# EasyEDA Pro project ProProject_赤兔主板（夜燕flex）111_2024-08-22.epro, board 赤兔-PCB
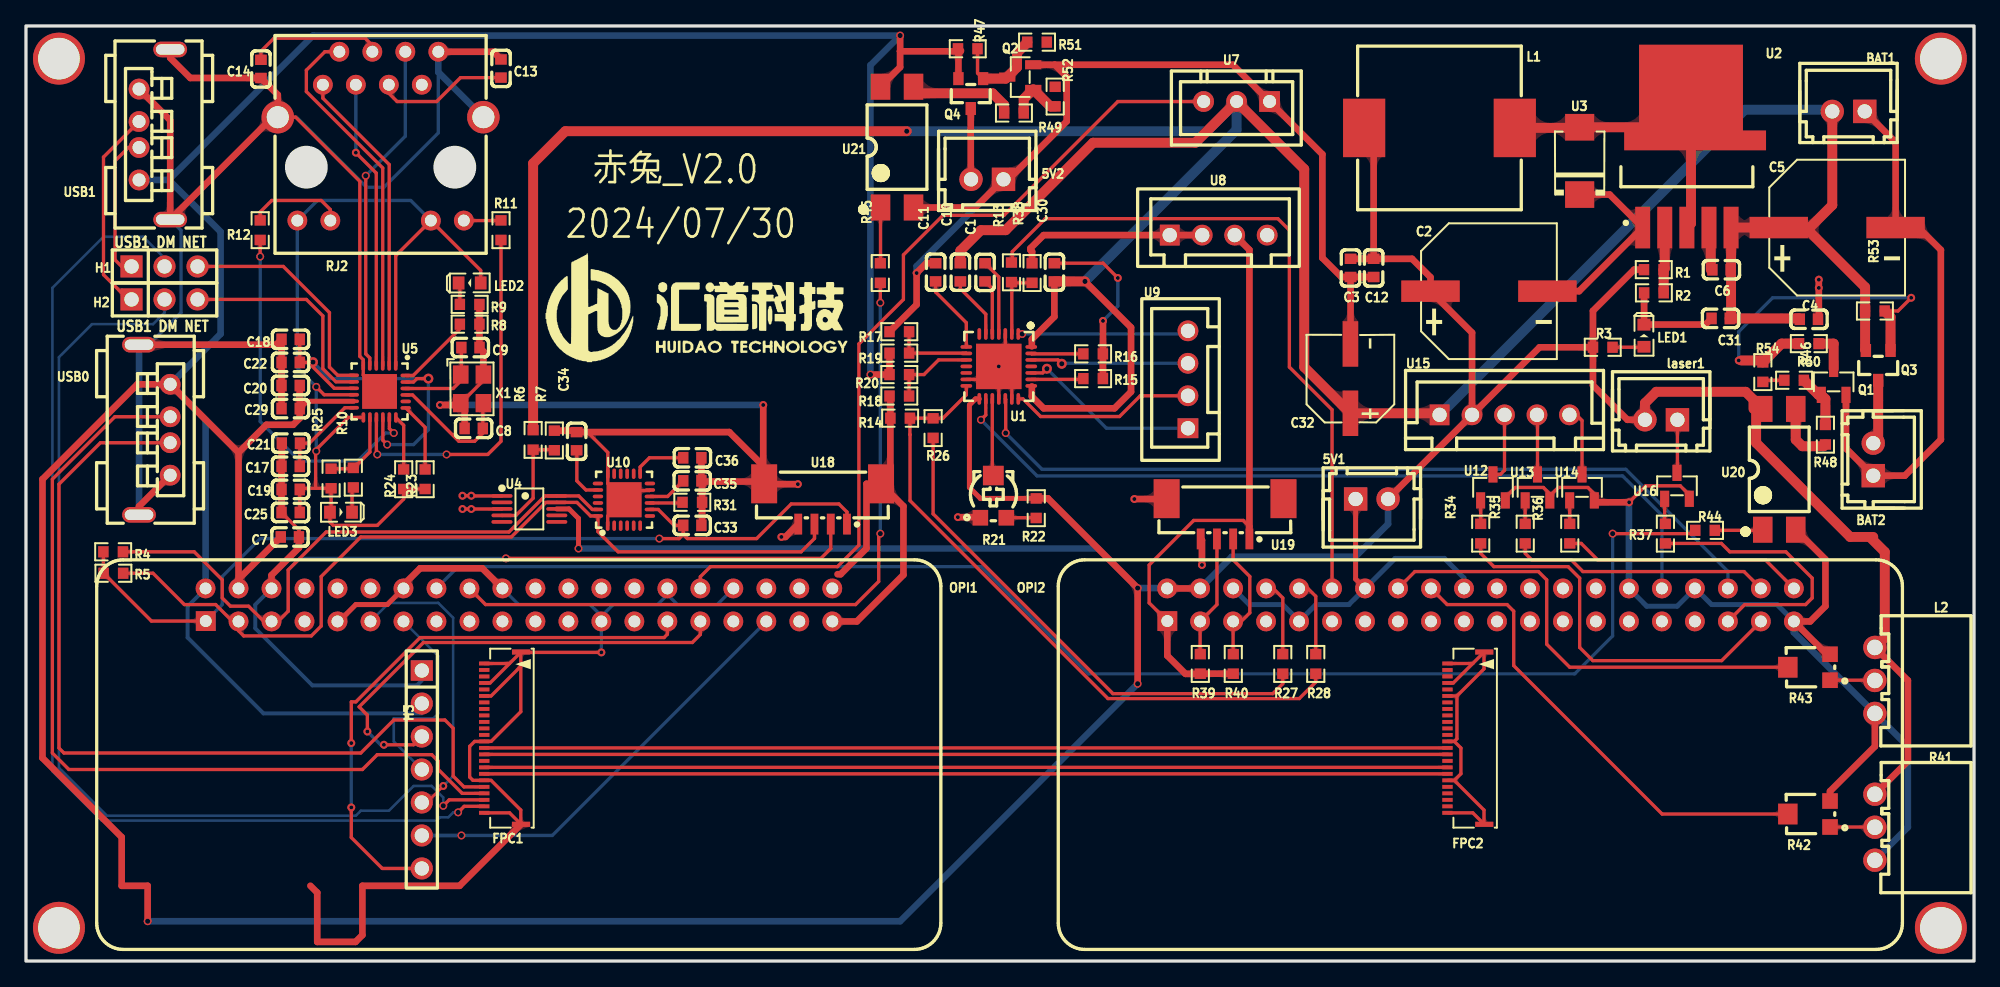
[diagram p6: board, top side]
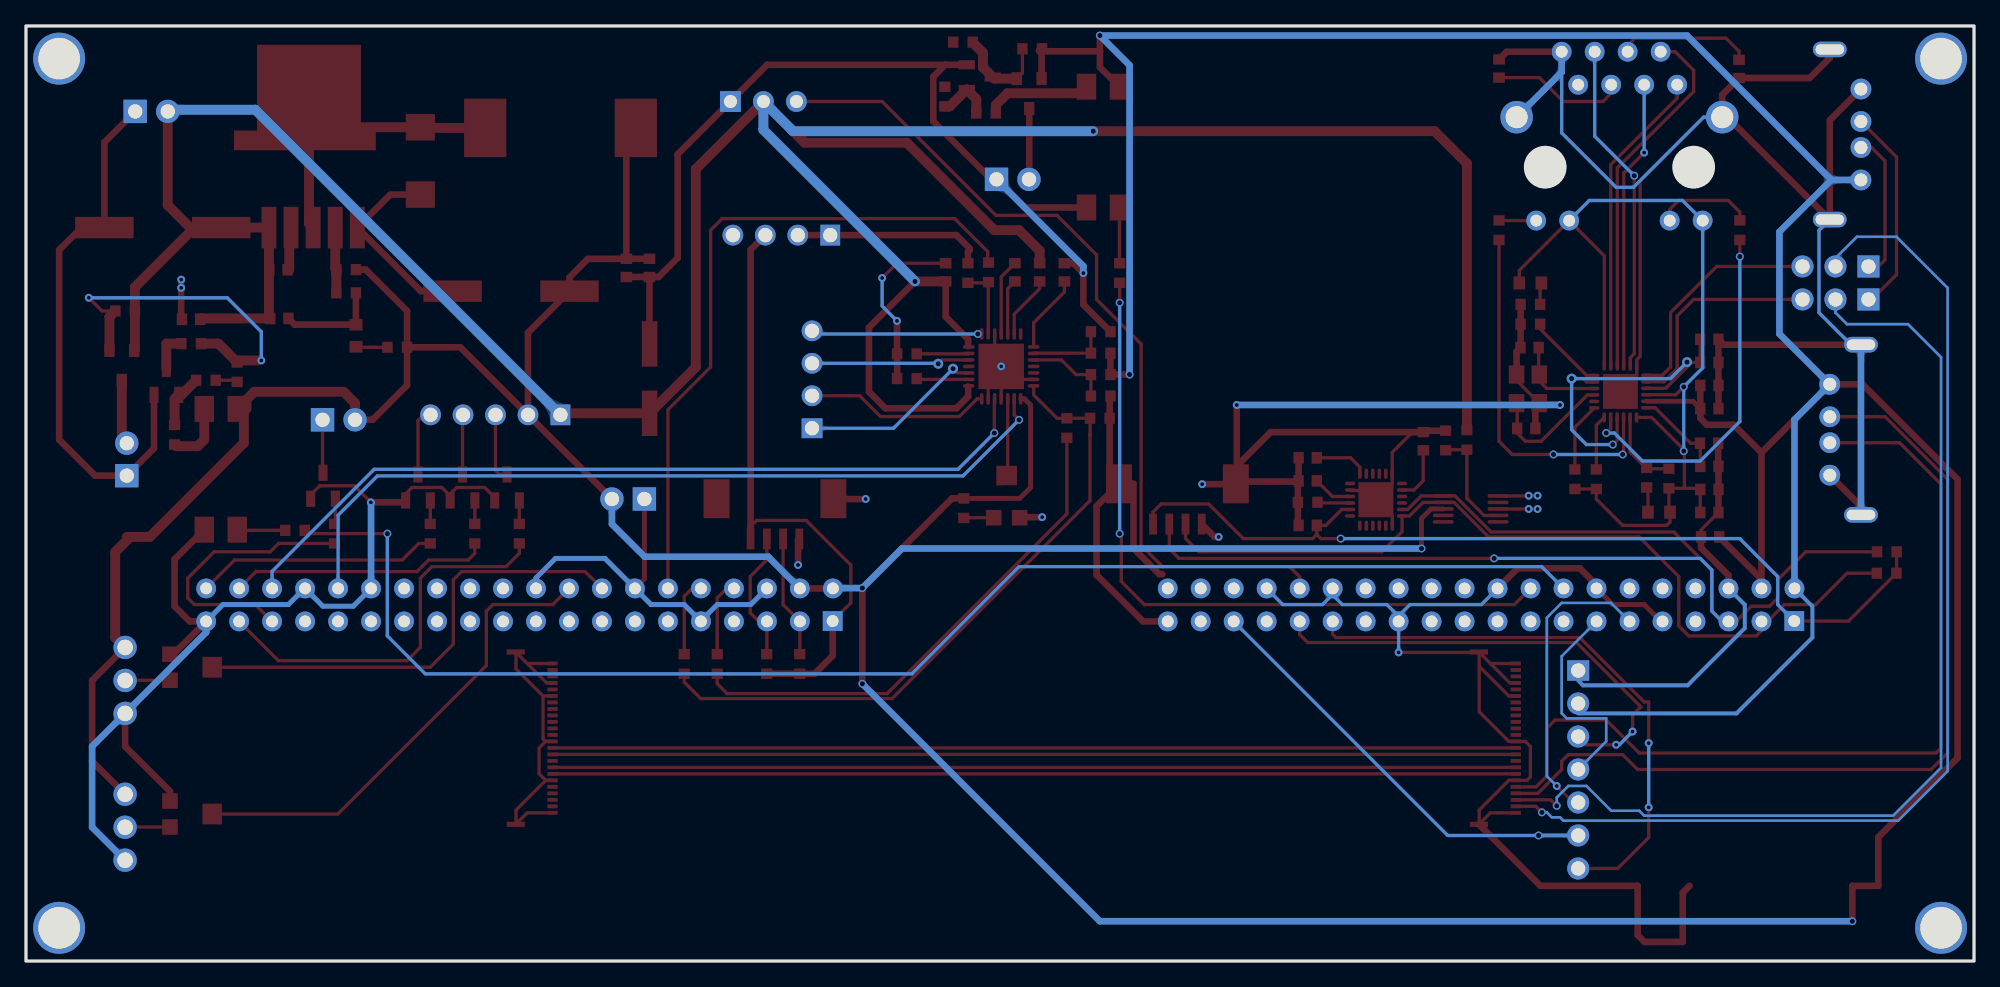
[diagram p7: board, bottom side, seen from below]

Outline 150 x 72 mm; copper layers: Top Layer, Bottom Layer. Coordinates in mm from the lower left corner of the outline.
Outline path: rectangle 0,72 150,0
Stack: Top Layer 0.035mm / Dielectric1 1.51mm FR4 er 4.5 / Bottom Layer 0.035mm

## Design rules (mm)
net USB3-DM1: DP1
net USB3-DP1: DP1
template: 自定义配置
spacing copperThickness1oz (default): track to track 0.102, other pairs 0.152 to 0.3
spacing copperThickness2oz: track to track 0.203, other pairs 0.152 to 0.3
track width copperThickness1oz (default): min 0.127, default 0.254, max 2.54
track width copperThickness2oz: min 0.203, default 0.254, max 2.54
differential pair differentialPair (default): width min 0.127, default 0.254, max 2.54; gap min 0.152, default 0.152
via viaSize (default): diameter min 0.5, default 0.61, max 10; hole min 0.3, default 0.305, max 6.3
net GND uses copperThickness2oz

## Placement (name value [footprint] x y rotation side)
5V1  ZX-XH2.54-2PZZ  [CONN-TH_2P-P2.50_HX25003-2A]  103.63 35.58 0 top
5V2  ZX-XH2.54-2PZZ  [CONN-TH_2P-P2.50_HX25003-2A]  74.02 60.19 180 top
BAT1  ZX-XH2.54-2PZZ  [CONN-TH_2P-P2.50_HX25003-2A]  140.34 65.42 180 top
BAT2  ZX-XH2.54-2PZZ  [CONN-TH_2P-P2.50_HX25003-2A]  142.24 38.62 90 top
C1  22nF  [C0603]  73.85 53.03 90 top
C2  220uF  [CAP-SMD_BD10.0-L10.3-W10.3-LS11.0-FD]  112.65 51.58 0 top
C3  100nF  [C0603]  101.99 53.37 90 top
C4  100nF  [C0603]  137.29 49.42 180 top
C5  220uF  [CAP-SMD_BD10.0-L10.3-W10.3-LS11.0-FD]  139.46 56.48 0 top
C6  1uF  [C0603]  130.56 53.23 0 top
C7  100nF  [C0603]  20.32 32.66 180 top
C8  22pF  [footprint_d276]  34.48 41.01 0 top
C9  22pF  [footprint_d276]  34.22 47.23 0 top
C10  100nF  [C0603]  71.95 53.03 270 top
C11  2.2u  [footprint_d276]  70.04 53.03 270 top
C12  100nF  [C0603]  103.77 53.37 90 top
C13  100nF  [C0603]  36.58 68.72 270 top
C14  100nF  [C0603]  18.09 68.69 90 top
C17  1uF  [C0603]  20.38 38.09 0 top
C18  1uF  [C0603]  20.38 47.87 0 top
C19  4.7uF  [C0603]  20.38 36.31 0 top
C20  4.7uF  [C0603]  20.38 44.31 0 top
C21  100nF  [C0603]  20.4 39.87 0 top
C22  100nF  [C0603]  20.38 46.09 0 top
C25  100nF  [C0603]  20.38 34.53 0 top
C29  100nF  [C0603]  20.38 42.54 0 top
C30  100nF  [C0603]  79.19 53.03 270 top
C31  100nF  [C0603]  130.49 49.48 0 top
C32  100uF  [CAP-SMD_BD6.3-L6.6-W6.6-LS7.4-FD]  101.98 44.85 90 top
C33  10nF  [C0603]  51.31 33.54 0 top
C34  2.2nF  [C0603]  42.4 40.03 90 top
C35  100nF  [C0603]  51.31 36.97 0 top
C36  100nF  [C0603]  51.31 38.75 180 top
FPC1  F0502-B-24-10G-R  [FPC-SMD_F0502-B-24-10G-R]  36.7 17.16 90 top
FPC2  F0502-B-24-10G-R  [FPC-SMD_F0502-B-24-10G-R]  110.87 17.16 90 top
H1  PZ254V-11-03P  [HDR-TH_3P-P2.54-V-M]  10.67 53.48 0 top
H2  PZ254V-11-03P  [HDR-TH_3P-P2.54-V-M]  10.67 50.94 0 top
H3  -  [HDR-TH_7P-P2.54-V-F]  30.48 14.75 270 top
L1  47uH  [IND-SMD_L13.8-W12.6_YSPI13XX]  108.84 64.15 0 top
L2  XH-3AW  [CONN-TH_3P-P2.54_HCTL_XH-3AW]  142.37 21.61 270 top
laser1  ZX-XH2.54-2PZZ  [CONN-TH_2P-P2.50_HX25003-2A]  125.91 41.68 180 top
LED1  LED-0603_R  [footprint_3abe]  124.59 48.15 90 top
LED2  LED-0603_R  [footprint_3abe]  34.16 52.21 180 top
LED3  LED-0603_R  [footprint_3abe]  24.26 34.56 0 top
NOREF  -  [Pad_e136]  147.45 2.56 0 top
NOREF#2  -  [Pad_e135]  2.54 2.56 0 top
NOREF#3  -  [Pad_e132]  147.45 69.48 0 top
NOREF#4  -  [Pad_e134]  2.54 69.48 0 top
OPI1  香橙派ZERO2W_正扣  [footprint_d6d0]  37.47 15 0 top
OPI2  香橙派ZERO2W_正扣  [footprint_d6d0]  111.51 15 0 top
Q1  S8050  [SOT-23-3_L2.9-W1.3-P1.90-LS2.4-BR]  139.19 44.59 270 top
Q2  S8050  [SOT-23-3_L2.9-W1.3-P1.90-LS2.4-BR]  76.56 68.06 0 top
Q3  AO3401A  [SOT-23_L2.9-W1.3-P1.90-LS2.4-BR]  142.62 45.86 90 top
Q4  AO3401A  [SOT-23_L2.9-W1.3-P1.90-LS2.4-BR]  72.75 66.79 90 top
R1  15k  [footprint_b147]  125.34 53.24 180 top
R2  4.7k  [footprint_b147]  125.35 51.45 0 top
R3  1k  [footprint_b147]  121.41 47.26 180 top
R4  10kΩ  [R0603]  6.71 31.51 180 top
R5  10kΩ  [R0603]  6.73 29.86 180 top
R6  100k  [footprint_b147]  39.05 40.13 90 top
R7  20k  [footprint_b147]  40.68 40.08 270 top
R8  2.49k  [footprint_b147]  34.16 49.04 0 top
R9  510R  [footprint_b147]  34.16 50.56 0 top
R10  510R  [footprint_b147]  25.21 37.22 90 top
R11  510R  [footprint_b147]  36.58 56.28 90 top
R12  510R  [footprint_b147]  18.03 56.28 270 top
R13  2k  [footprint_b147]  75.88 53.03 270 top
R14  20k  [footprint_b147]  67.31 41.8 0 top
R15  120mR  [footprint_b147]  82.17 44.85 0 top
R16  120mR  [footprint_b147]  82.17 46.75 0 top
R17  0  [footprint_b147]  67.25 48.46 0 top
R18  0  [footprint_b147]  67.25 43.51 0 top
R19  10kΩ  [R0603]  67.25 46.81 0 top
R20  10kΩ  [R0603]  67.25 45.16 0 top
R21  20kΩ  [footprint_3e76]  74.49 35.76 0 top
R22  20k  [footprint_b147]  77.79 34.87 90 top
R23  10kΩ  [R0603]  30.73 37.1 270 top
R24  10kΩ  [R0603]  29.08 37.1 270 top
R25  10kΩ  [R0603]  23.49 37.15 270 top
R26  1k  [footprint_b147]  69.85 41.04 90 top
R27  0  [footprint_b147]  96.77 22.88 270 top
R28  0  [footprint_b147]  99.31 22.88 270 top
R31  4.7K  [R0603]  51.31 35.32 180 top
R34  10  [R0603]  112.01 32.91 90 top
R35  10  [R0603]  115.44 32.91 90 top
R36  10  [R0603]  118.87 32.91 90 top
R37  10  [R0603]  126.24 32.91 90 top
R38  2K  [R0603]  77.47 52.97 90 top
R39  10kΩ  [R0603]  90.42 22.88 270 top
R40  10kΩ  [R0603]  92.96 22.88 270 top
R41  XH-3AW  [CONN-TH_3P-P2.54_HCTL_XH-3AW]  142.37 10.3 270 top
R42  10kΩ  [RES-ADJ-SMD_3P-L3.0-W3.8-P1.75-BR]  137.29 11.32 0 top
R43  10kΩ  [RES-ADJ-SMD_3P-L3.0-W3.8-P1.75-BR]  137.29 22.62 0 top
R44  330  [R0603]  129.29 33.16 0 top
R45  330  [R0603]  65.79 52.97 90 top
R46  5K  [R0603]  136.14 44.72 180 top
R47  200  [R0603]  72.52 70.25 180 top
R48  1K  [R0603]  138.56 40.53 90 top
R49  1K  [R0603]  76.07 65.29 0 top
R50  500  [R0603]  137.28 47.54 180 top
R51  10K  [R0603]  77.85 70.75 180 top
R52  5K  [R0603]  79.25 66.56 270 top
R53  500  [R0603]  142.37 50.05 180 top
R54  10K  [R0603]  133.74 45.35 90 top
RJ2  R-RJ45S08P-C000  [RJ45-TH_R-RJ45S08P-C000]  27.31 63.52 0 top
U1  TMC2209-LA  [footprint_e6f4]  74.91 45.79 180 top
U2  XL4015E1  [footprint_c660]  127.89 61.48 90 top
U3  SS54_C5200096  [footprint_a0e0]  119.63 61.61 90 top
U4  ADS1115IDGSR  [footprint_abbe]  38.76 34.81 270 top
U5  RTL8152B-VB-CG  [footprint_86b9]  27.24 43.86 270 top
U7  ZX-XH2.54-3PZZ  [CONN-TH_3P-P2.54_2501S-3P]  93.22 66.18 180 top
U8  ZX-XH2.54-4PZZ  [CONN-TH_4P-P2.50_4PIN]  91.82 55.9 0 top
U9  ZX-XH2.54-4PZZ  [CONN-TH_4P-P2.50_4PIN]  89.47 44.78 90 top
U10  MPU-6050_C24112  [QFN-24_L4.0-W4.0-P0.50-BL-EP2.7]  46.04 35.52 0 top
U12  2N7002K_C3008053  [SOT-23-3_L2.9-W1.3-P1.90-LS2.4-BL-1]  112.96 36.47 0 top
U13  2N7002K_C3008053  [SOT-23-3_L2.9-W1.3-P1.90-LS2.4-BL-1]  116.39 36.47 0 top
U14  2N7002K_C3008053  [SOT-23-3_L2.9-W1.3-P1.90-LS2.4-BL-1]  119.82 36.47 0 top
U15  ZX-XH2.54-5PZZ  [CONN-TH_5P-P2.50_ZX-XH2.54-5PZZ]  113.85 42.06 0 top
U16  2N7002K_C3008053  [SOT-23-3_L2.9-W1.3-P1.90-LS2.4-BL-1]  127.13 36.59 0 top
U18  HCZZ0015-4  [CONN-SMD_4P-P1.25_HCZZ0015-4]  61.34 35.19 180 top
U19  HCZZ0015-4  [CONN-SMD_4P-P1.25_HCZZ0015-4]  92.33 34.05 180 top
U20  PC817X2CSP9F  [SMD-4_L4.6-W6.5-P2.54-LS10.2-TL]  135 37.86 90 top
U21  PC817X2CSP9F  [SMD-4_L4.6-W6.5-P2.54-LS10.2-TL]  67.07 62.67 90 top
USB0  AF 180°ZJB13.7  [USB-A-TH_AF-ZJB13.7]  9.91 40.91 270 top
USB1  AF 180°ZJB13.7  [USB-A-TH_AF-ZJB13.7]  9.91 63.64 90 top
X1  25MHz  [OSC-SMD_4P-L3.2-W2.5-BL]  34.35 44.06 270 top

## Footprints (pads in the part's own frame, mm; a bottom-side part is the same pattern mirrored in y, then rotated)
C0603
  rect 0.8x0.9 smd: 1(-0.7,0) 2(0.7,0)
CAP-SMD_BD6.3-L6.6-W6.6-LS7.4-FD
  rect 3.5x1.2 smd: 1(-2.67,0) 2(2.67,0)
CAP-SMD_BD10.0-L10.3-W10.3-LS11.0-FD
  rect 4.5x1.65 smd: 1(-4.5,0) 2(4.5,0)
CONN-SMD_4P-P1.25_HCZZ0015-4
  rect 0.6x1.6 smd: 1(-1.875,1.55) 2(-0.625,1.55) 3(0.625,1.55) 4(1.875,1.55)
  rect 2x3 smd: 5(-4.5,-1.55) 6(4.5,-1.55)
CONN-TH_2P-P2.50_HX25003-2A
  rect 1.8x1.8 hole 1.1: 1(-1.25,0)
  round 1.8 hole 1.1: 2(1.25,0)
CONN-TH_3P-P2.54_2501S-3P
  rect 1.6x1.6 hole 1: 1(-2.54,0)
  round 1.6 hole 1: 2(0,0) 3(2.54,0)
CONN-TH_3P-P2.54_HCTL_XH-3AW
  round 1.8 hole 1.199: 1(-2.54,0) 2(0.002,0) 3(2.54,0)
CONN-TH_4P-P2.50_4PIN
  rect 1.524x1.6 hole 1.1: 1(-3.75,0)
  round 1.6 hole 1.1: 2(-1.25,0) 3(1.25,0) 4(3.75,0)
CONN-TH_5P-P2.50_ZX-XH2.54-5PZZ
  rect 1.524x1.6 hole 1.1: 1(-5,0)
  round 1.6 hole 1.1: 2(-2.5,0) 3(0,0) 4(2.5,0) 5(5,0)
footprint_3abe
  rect 0.9x1 smd: 1(-0.85,0) 2(0.85,0)
footprint_3e76
  rect 1.2x1.2 smd: 1(-1,-1.625) 3(1,-1.625)
  rect 1.6x1.5 smd: 2(0,1.625)
footprint_86b9
  oval 0.8x0.28 smd: 1(-2,1.232) 2(-2,0.732) 3(-2,0.231) 4(-2,-0.267) 5(-2,-0.767) 6(-2,-1.268) 13(2,-1.258) 14(2,-0.757) 15(2,-0.257) 16(2,0.241) 17(2,0.742) 18(2,1.242)
  oval 0.28x0.8 smd: 7(-1.244,-2) 8(-0.744,-2) 9(-0.244,-2) 10(0.254,-2) 11(0.754,-2) 12(1.255,-2) 19(1.27,2) 20(0.769,2) 21(0.269,2) 22(-0.229,2) 23(-0.729,2) 24(-1.23,2)
  rect 2.68x2.68 smd: 25(0,-0.013)
footprint_a0e0
  rect 2.047x2.241 smd: 1(-2.591,0) 2(2.591,0)
footprint_abbe
  oval 0.28x1.62 smd: 1(-1,-2.11) 2(-0.5,-2.11) 3(0,-2.11) 4(0.5,-2.11) 5(1,-2.11) 6(1,2.11) 7(0.5,2.11) 8(0,2.11) 9(-0.5,2.11) 10(-1,2.11)
footprint_b147
  rect 0.806x0.864 smd: 1(-0.753,0) 2(0.753,0)
footprint_c660
  rect 3.2x1.15 smd: 1(-5.008,3.404) 2(-5.008,1.702) 3(-5.008,0) 4(-5.008,-1.702) 5(-5.008,-3.404)
  custom 8.128x10.922 smd: 6(5.008,-0.318)
footprint_d6d0
  rect 1.524x1.524 hole 0.914: 1(-23.622,11.176)
  round 1.524 hole 0.914: 2(-21.098,11.148) 3(-18.558,11.148) 4(-16.018,11.148) 5(-13.478,11.148) 6(-10.938,11.148) 7(-8.398,11.148) 8(-5.858,11.148) 9(-3.318,11.148) 10(-0.778,11.148) 11(1.762,11.148) 12(4.302,11.148) 13(6.841,11.148) 14(9.382,11.148) 15(11.921,11.148) 16(14.461,11.148) 17(17.002,11.148) 18(19.541,11.148) 19(22.081,11.148) 20(24.622,11.148) 21(24.622,13.688) 22(22.081,13.688) 23(19.541,13.688) 24(17.002,13.688) 25(14.461,13.688) 26(11.921,13.688) 27(9.382,13.688) 28(6.841,13.688) 29(4.302,13.688) 30(1.762,13.688) 31(-0.778,13.688) 32(-3.318,13.688) 33(-5.858,13.688) 34(-8.398,13.688) 35(-10.938,13.688) 36(-13.478,13.688) 37(-16.018,13.688) 38(-18.558,13.688) 39(-21.098,13.688) 40(-23.638,13.688)
footprint_d276
  rect 0.8x0.9 smd: 1(-0.7,0) 2(0.7,0)
footprint_e6f4
  oval 0.28x0.9 smd: 1(-1.501,-2.5) 2(-1.001,-2.5) 3(-0.5,-2.5) 4(0,-2.5) 5(0.5,-2.5) 6(1.001,-2.5) 7(1.501,-2.5) 15(1.501,2.5) 16(1.001,2.5) 17(0.5,2.5) 18(0,2.5) 19(-0.5,2.5) 20(-1.001,2.5) 21(-1.501,2.5)
  oval 0.9x0.28 smd: 8(2.5,-1.501) 9(2.5,-1.001) 10(2.5,-0.5) 11(2.5,0) 12(2.5,0.5) 13(2.5,1.001) 14(2.5,1.501) 22(-2.5,1.501) 23(-2.5,1.001) 24(-2.5,0.5) 25(-2.5,0) 26(-2.5,-0.5) 27(-2.5,-1.001) 28(-2.5,-1.501)
  rect 3.5x3.5 smd: 29(-0.001,0)
FPC-SMD_F0502-B-24-10G-R
  rect 0.3x0.8 smd: 1(5.75,1.417) 2(5.25,1.417) 3(4.75,1.417) 4(4.25,1.417) 5(3.75,1.417) 6(3.25,1.417) 7(2.751,1.417) 8(2.25,1.417) 9(1.75,1.417) 10(1.25,1.417) 11(0.75,1.417) 12(0.25,1.417) 13(-0.25,1.417) 14(-0.75,1.417) 15(-1.25,1.417) 16(-1.75,1.417) 17(-2.25,1.417) 18(-2.75,1.417) 19(-3.25,1.417) 20(-3.75,1.417) 21(-4.25,1.417) 22(-4.75,1.417) 23(-5.25,1.417) 24(-5.75,1.417)
  rect 0.4x1.4 smd: 25(-6.635,-1.417) 26(6.635,-1.417)
HDR-TH_3P-P2.54-V-M
  rect 1.7x1.7 hole 1.1: 1(-2.54,0)
  round 1.7 hole 1.1: 2(0,0) 3(2.54,0)
HDR-TH_7P-P2.54-V-F
  rect 1.575x1.7 hole 1.1: 1(-7.62,0)
  round 1.7 hole 1.1: 2(-5.08,0) 3(-2.54,0) 4(0,0) 5(2.54,0) 6(5.08,0) 7(7.62,0)
IND-SMD_L13.8-W12.6_YSPI13XX
  rect 3.25x4.5 smd: 1(-5.8,0) 2(5.8,0)
OSC-SMD_4P-L3.2-W2.5-BL
  rect 1.4x1.2 smd: 1(-1.1,-0.875) 2(1.1,-0.875) 3(1.1,0.875) 4(-1.1,0.875)
Pad_e132
  round 4 hole 3.2: 0(0,0)
Pad_e134
  round 4 hole 3.2: 0(0,0)
Pad_e135
  round 4 hole 3.2: 0(0,0)
Pad_e136
  round 4 hole 3.2: 0(0,0)
QFN-24_L4.0-W4.0-P0.50-BL-EP2.7
  oval 0.28x0.8 smd: 1(-1.25,-2) 2(-0.75,-2) 3(-0.25,-2) 4(0.25,-2) 5(0.75,-2) 6(1.25,-2) 13(1.25,2) 14(0.75,2) 15(0.25,2) 16(-0.25,2) 17(-0.75,2) 18(-1.242,2)
  oval 0.8x0.28 smd: 7(2,-1.25) 8(2,-0.75) 9(2,-0.25) 10(2,0.25) 11(2,0.75) 12(2,1.25) 19(-2,1.25) 20(-2,0.75) 21(-2,0.25) 22(-2,-0.25) 23(-2,-0.75) 24(-2,-1.25)
  rect 2.7x2.7 smd: 25(0.013,0)
R0603
  rect 0.806x0.864 smd: 1(-0.753,0) 2(0.753,0)
RES-ADJ-SMD_3P-L3.0-W3.8-P1.75-BR
  rect 1.2x1.2 smd: 1(1.625,-1) 3(1.625,1)
  rect 1.5x1.6 smd: 2(-1.625,0)
RJ45-TH_R-RJ45S08P-C000
  round 1.524 hole 0.914: 1(-4.445,3.96) 2(-3.175,6.5) 3(-1.905,3.96) 4(-0.635,6.5) 5(0.635,3.96) 6(1.905,6.5) 7(3.175,3.96) 8(4.445,6.5) 9(-6.41,-6.5) 10(-3.87,-6.5) 11(3.87,-6.5) 12(6.41,-6.5)
  round 2.5 hole 1.7: 13(-7.915,1.46) 14(7.915,1.46)
SMD-4_L4.6-W6.5-P2.54-LS10.2-TL
  rect 2x1.5 smd: 1(-4.65,1.27) 2(-4.65,-1.27) 3(4.65,-1.27) 4(4.65,1.27)
SOT-23-3_L2.9-W1.3-P1.90-LS2.4-BL-1
  rect 0.7x1.25 smd: 1(-0.95,-1) 2(0.95,-1) 3(0,1)
SOT-23-3_L2.9-W1.3-P1.90-LS2.4-BR
  rect 1.25x0.7 smd: 1(1,-0.95) 2(1,0.95) 3(-1,0)
SOT-23_L2.9-W1.3-P1.90-LS2.4-BR
  rect 1x0.8 smd: 1(1.15,-0.95) 2(1.15,0.95) 3(-1.15,0)
USB-A-TH_AF-ZJB13.7
  round 1.6 hole 1: 1(-3.5,1.2) 2(-1,1.2) 3(1,1.2) 4(3.5,1.2)
  oval 1.2x2.6 hole 0.8x2.2: 5(-6.55,-1.2) 5(6.55,-1.2)

## Nets
As in the schematic.

Pads without a net: FPC1 2 3 5 7 8 9 10 11 12 16; FPC2 2 3 5 7 8 9 10 11 12 16; NOREF 0; NOREF#2 0; NOREF#3 0; NOREF#4 0; OPI1 4 8 9 10 11 12 14 17 19 21 22 23 27 28 29 30 35 36 37; OPI2 4 6 7 8 9 10 11 12 14 15 16 17 27 28 29 30; RJ2 7; U1 11 12 25; U4 5 6 7; U10 2 3 4 5 6 7 12 14 15 16 17 19 21 22

## Via types
v1: diameter 0.61, hole 0.305, Top Layer to Bottom Layer, 27 vias
v2: diameter 0.61, hole 0.4, Top Layer to Bottom Layer, 27 vias
v3: diameter 0.762, hole 0.4, Top Layer to Bottom Layer, 4 vias

## Routing (per net, layer and track width the routed paths; a pad name or vN(x,y) marks a point on that pad's centre or on a via; arc(x,y) is an arc through that point)
3V3: length 4.1
  Top Layer w0.254: C36.2 48.01,38.75 47.29,38.04 U10.13
3V3_1: length 70.6
  Top Layer w0.254: U18.1 63.22,34.57 62.59,35.19 58.93,35.19 56.26,32.53 50.93,32.53 50.61,32.85 ; 50.61,32.85 C33.1 49.91,33.54 48.68,34.77 U10.8 ; 50.61,32.85 50.29,32.53 v2(48.77,32.53) ; OPI1.1 9.66,26.18 R5.2 5.96,29.88 R4.2
  Bottom Layer w0.254: v2(48.77,32.53) 18.03,32.53 15.11,29.61 15.11,27.45 OPI1.1
3V3_2: length 46.4
  Top Layer w0.254: 94.2,33.45 93.73,33.92 89.92,33.92 86.49,30.5 86.49,27.58 OPI2.1
  Top Layer w0.508: U8.3 94.2,54.76 U19.1 ; OPI2.1 87.88,23.51 89.28,22.11 90.42,22.11 R39.2 R40.2
24V: length 263.9
  Top Layer w0.508: 77.45,44.24 77.45,43.47 78.36,42.56 83.82,42.56 85.09,43.83 85.09,48.78 v2(81.54,52.33) ; 77.45,47.33 77.45,47.88 79.19,49.61 C30.2
  Top Layer w0.762: 137.02,56.48 141.61,51.89 R53.2 141.61,47.07 Q3.2 ; 137.02,56.48 C5.1 ; 137.02,56.48 137.36,56.48 139.09,58.2 BAT1.2 ; v2(81.54,52.33) C30.2 ; 134.96,56.48 U2.5 131.29,49.58 C31.2 136.53,49.48 C4.2 ; C10.1 71.95,54.69 73.53,56.28 75.44,56.28 82.17,63.01 90.04,63.01 U7.2 98.43,60.98 98.43,45.73 C32.1 108.73,42.18 U15.1 ; R6.2 39.05,61.42 41.53,63.9 v2(67.82,63.9)
  Bottom Layer w0.762: BAT1.2 138.96,65.55 132.34,65.55 U15.1 ; v2(81.54,52.33) 93.22,64.01 U7.2 90.93,63.9 v2(67.82,63.9)
+5V: length 552.5
  Top Layer w0.381: U4.8 41.81,34.81 42.55,34.08 v2(42.55,31.77) ; R22.2 73.49,35.62 72.64,36.47 72.64,42.81 73.11,43.29 U1.15 ; U5.11 21.65,43.1 C29.2
  Top Layer w0.508: C3.2 C12.2 ; C12.2 103.77,63.42 L1.1 ; C12.2 106.73,54.07 108.15,52.65 C2.1 111.35,48.38 U15.2 ; L2.1 144.91,21.61 144.91,15.38 R41.1 ; R3.2 120.66,44.33 123.31,41.68 laser1.2 ; R3.2 116.55,47.26 U15.2 ; R3.2 120.66,50.06 123.83,53.24 R1.2 ; v2(85.6,21.35) v2(85.6,28.72) 78.69,35.62 R22.2 ; 71.95,70.05 71.8,69.9 Q4.2 ; 71.95,70.05 67.31,70.05 ; 71.95,70.05 72,70.1 ; R19.1 R20.1 v2(65.02,45.16) ; C7.2 16.37,29.4 ; 16.37,29.4 OPI1.39 ; 16.37,29.4 16.37,39.15 ; v2(67.31,71.26) 67.31,70.05 67.31,70.05 ; U15.2 104.88,35.59 5V1.2 ; v2(9.37,3.06) 9.37,5.79 7.37,5.79 7.37,9.54 1.27,15.64 1.27,37.1 8.58,44.41 USB0.1 16.37,39.15 ; C20.2 C29.2 21.08,41.8 20.57,41.29 18.51,41.29 16.37,39.15 ; OPI2.40 OPI2.39 ; 67.31,70.05 67.31,68.83 U21.4
  Top Layer w0.762: 141.97,32.66 142.24,32.66 ; 141.97,32.66 140.46,32.66 133.22,39.89 133.22,42.31 ; 141.97,32.66 143.13,31.5 143.13,24.91 L2.1 ; laser1.2 124.66,42.96 125.54,43.83 132.41,43.83 133.02,43.22 133.02,42.51
  Bottom Layer w0.3: 30.48,19.07 18.29,19.07 12.45,24.91 12.45,27.31 OPI1.40
  Bottom Layer w0.508: 10.98,60.14 10.99,60.14 14.99,56.15 14.99,48.29 USB0.1 13.83,41.69 OPI1.40 ; 10.98,60.14 USB1.1 ; 10.98,60.14 22.1,71.26 v2(67.31,71.26) 65.02,68.98 v2(65.02,45.16) ; OPI2.40 87.84,28.72 v2(85.6,28.72) 82.55,31.77 v2(42.55,31.77) ; v2(85.6,21.35) 67.31,3.06 v2(9.37,3.06) ; OPI2.39 92.85,31.13 102.36,31.13 104.88,33.65 5V1.2
GND: length 714.4
  Top Layer w0.254: 38.1,10.55 FPC1.25 ; 38.1,10.55 38.1,11.62 35.81,13.91 FPC1.19 34.42,13.91 34.16,14.17 34.16,16.53 34.54,16.91 35.28,16.91 FPC1.13 35.81,16.91 38.1,19.2 38.1,22.7 ; 38.1,10.55 37.24,11.41 FPC1.24 ; U4.1 34.31,35.81 v1(34.29,35.83) ; X1.4 35.22,44.71 X1.2 ; 37.24,22.91 35.74,21.41 FPC1.4 ; 37.24,22.91 FPC1.1 ; 37.24,22.91 38.1,23.78 ; 111.4,22.91 109.9,21.41 FPC2.4 ; 111.4,22.91 112.27,23.78 ; 111.4,22.91 FPC2.1 ; 112.27,10.55 FPC2.25 ; 112.27,10.55 112.27,11.62 109.98,13.91 ; 112.27,10.55 111.4,11.41 FPC2.24 ; 43.24,40.73 44.8,39.16 U10.18 44.8,36.78 U10.25 ; C25.1 21.02,33.19 C7.1 ; U1.18 v1(74.91,45.79) ; v1(74.91,45.79) 73.91,44.78 U1.13 ; v1(74.91,45.79) 75.41,46.29 U1.3 ; v1(74.91,45.79) 75.91,44.78 U1.20 ; FPC1.6 35.81,20.41 38.1,22.7 ; R54.1 133.87,44.72 R46.2 ; 110.18,20.41 112.27,22.5 112.27,23.78 ; 110.18,20.41 110.18,17.11 109.98,16.91 ; 110.18,20.41 FPC2.6 ; 38.1,23.78 FPC1.26 38.15,23.77 v1(44.31,23.77) ; 38.1,23.78 38.1,22.7 ; U13.2 117.34,35.82 ; 117.34,35.82 117.98,36.47 120.27,36.47 120.77,35.97 U14.2 ; 117.34,35.82 117.34,35.97 116.84,36.47 114.68,36.47 113.91,35.69 U12.2 ; RJ2.13 20.77,64.98 25.7,60.04 25.7,46.56 25.97,46.3 U5.6 25.97,45.11 U5.25 ; 109.98,16.91 110.49,16.4 110.49,14.42 109.98,13.91 ; 109.98,16.91 FPC2.13 ; C30.1 82.94,53.73 v1(84.07,52.59) ; 112.27,23.78 FPC2.26 ; U4.3 36.65,34.81 v1(34.29,34.81) v1(33.61,34.81) ; 109.98,13.91 FPC2.19 ; 48.04,36.27 48,36.23 46.76,36.23 U10.25 ; U16.2 128.08,35.9 127.38,36.59 124.71,36.59 v1(123.44,35.32) ; U10.1 44.79,34.26 U10.25 ; 34.29,35.83 v1(33.61,35.83)
  Top Layer w0.381: OPI2.34 102.38,29.42 5V1.1 ; OPI1.5 24.1,26.15 25.4,27.45 27.82,27.45 OPI1.34
  Top Layer w0.508: R43.3 138.66,23.62 OPI2.20 137.39,26.15 138.56,27.32 138.56,30.93 U20.2 ; U14.2 120.91,35.32 v1(123.44,35.32) ; 52.06,36.92 R31.1 52.06,33.6 C33.2 ; 52.06,36.92 56.67,36.92 ; 52.06,36.92 C35.2 C36.1 ; X1.4 35.22,46.93 C9.2 34.92,47.24 R8.2 R9.2 ; Q1.2 140.14,39.47 BAT2.1 144.67,37.37 147.45,40.15 147.45,54.75 145.72,56.48 C5.2 143.96,63.04 BAT1.1 ; 56.67,36.92 56.67,38.22 54.16,40.73 C34.2 42.29,40.84 R7.1 ; 56.67,36.92 56.77,36.82 ; OPI1.38 18.91,29.71 21.02,31.82 C7.1 ; C21.1 19.7,38.11 C17.1 C19.1 C25.1 ; v1(58.17,32.66) 58.48,32.66 U18.4 ; v1(82.93,49.29) 82.93,46.76 R16.2 R15.2 ; U18.5 64.72,36.75 64.72,31.78 62.73,29.78 62.49,29.78 ; U18.5 66.56,37.46 R14.1 66.56,43.44 R18.1 ; U18.5 67.56,35.02 67.56,29.73 63.98,26.15 OPI1.20 ; OPI1.31 35.14,30.24 30.35,30.24 29.07,28.96 OPI1.34 ; USB1.5 11.11,69.54 12.65,68 18.09,68 19.39,66.7 RJ2.13 18.99,64.98 USB1.5 11.11,64.74 USB1.4 ; v1(59.44,36.72) 56.87,36.72 56.77,36.82 ; 79.21,69.01 92.93,69.01 U7.1 99.82,62.12 99.82,54.14 101.29,52.67 C3.1 ; 79.21,69.01 80.14,68.09 80.14,64.66 75.67,60.19 5V2.1 73.1,58.02 U21.2 ; 79.21,69.01 Q2.2 ; v1(138.05,52.47) v1(138.05,51.83) 138.05,49.48 C4.1 ; v1(85.34,35.58) 87.8,35.58 U19.6 ; C3.1 C12.1 ; C3.1 101.99,47.53 C32.2 ; C8.1 33.78,42.66 X1.2 33.33,42.81 v1(31.88,42.81) ; U3.1 121.94,59.02 U2.1 119.59,51.58 C2.2 ; 124.6,49.01 129.32,49.01 C31.1 ; 124.6,49.01 LED1.2 ; 124.6,49.01 R2.1 ; v1(71.75,34.18) 73.44,34.18 R21.1 ; C13.1 35.98,70.02 RJ2.8 ; FPC1.25 33.39,5.79 25.9,5.79 25.9,2 25.38,1.47 22.43,1.47 22.43,5.27 21.9,5.79 ; 56.77,36.82 v1(56.77,42.81) ; U19.4 90.55,32.4 v1(90.55,30.5) ; C29.1 C20.1 C22.1 C18.1 19.27,47.46 USB0.5 ; 70.04,53.73 69.34,53.73 v1(68.58,52.97) 68.58,50.55 R17.1 ; R42.3 138.91,13.07 142.37,16.53 L2.3 ; USB0.5 8.71,35.01 USB0.4
  Bottom Layer w0.254: OPI1.31 37.93,27.45 43.43,27.45 44.31,26.58 44.31,26.54 ; USB0.5 9.47,47.46 11.94,49.93 11.94,56.26 USB1.5 ; OPI1.24 53.22,27.45 50.17,27.45 49.39,28.23 ; v1(82.93,49.29) 84.07,50.44 v1(84.07,52.59) ; 31.75,68.45 31.75,63.77 27.56,59.58 26.22,59.58 20.83,64.98 RJ2.13 ; 44.31,26.54 OPI1.13 v1(44.31,23.77) ; 44.31,26.54 45.21,27.45 48.64,27.45 49.39,28.19 49.39,28.23 ; 49.39,28.23 OPI1.26
  Bottom Layer w0.3: 30.48,21.61 30.1,21.22 22.05,21.22 17.65,25.62 17.65,27.44 OPI1.38
  Bottom Layer w0.381: OPI2.26 124.8,27.32 127.14,27.32 OPI2.24 128.55,28.69 129.79,27.45 134.83,27.45 OPI2.20 ; OPI2.38 94.19,27.45 96.77,27.45 98.03,26.19 OPI2.5 99.33,27.45 101.87,27.45 OPI2.34 105.42,31 109.22,31 110.73,29.5 OPI2.31
  Bottom Layer w0.508: RJ2.14 31.75,68.45 RJ2.8 ; R41.3 144.91,10.3 144.91,16.53 L2.3 136.13,25.31 OPI2.20 ; v1(68.58,52.97) 68.58,53.5 5V2.1 ; OPI2.26 123.43,35.31 v1(123.44,35.32) ; USB0.5 USB0.5 ; v1(31.88,42.81) v1(56.77,42.81)
VDD10: length 28.2
  Top Layer w0.254: C18.2 C22.2 21.75,46.09 ; U5.16 27.48,40.1 v2(27.81,39.77) ; v3(30.99,44.85) 30.1,44.85 29.84,44.59 U5.23 ; 21.75,46.09 22.07,46.09 v3(22.1,46.12) ; 21.75,46.09 23.74,44.1 U5.9
  Bottom Layer w0.254: v2(27.81,39.77) 29.84,39.77 30.99,40.91 v3(30.99,44.85) 23.37,44.85 v3(22.1,46.12)
VDD10_UPS: length 7.1
  Top Layer w0.254: C17.2 21.08,39.85 C21.2 21.82,39.87 24.55,42.6 25.24,42.6
VDD33: length 75.4
  Top Layer w0.254: 22.3,36.4 R25.2 23.49,34.65 LED3.1 23.41,33.8 23.66,33.54 27.05,33.54 29.08,35.58 R24.2 R23.2 ; 22.3,36.4 21.17,36.4 C19.2 C25.2 ; 22.3,36.4 22.3,39.34 ; U5.13 24.82,41.86 22.3,39.34 ; 22.3,39.34 22.35,39.29 v2(22.35,39.26) ; LED2.1 35.01,53.18 RJ2.11 28.47,54.31 U5.1 ; v2(22.35,44.21) 22.96,43.6 U5.10
  Bottom Layer w0.254: RJ2.11 29.63,58.56 22.44,58.56 RJ2.9 20.89,45.67 v2(22.35,44.21) v2(22.35,39.26)
A1: length 14.1
  Top Layer w0.254: v3(78.61,45.61) 78.29,45.28 U1.24
  Bottom Layer w0.254: U9.1 83.2,41.03 v3(78.61,45.61)
A2: length 14.3
  Top Layer w0.254: U1.21 76.77,43.29 78.13,41.93 84.2,41.93 85.8,43.53 U9.2
B1: length 12.2
  Top Layer w0.254: U1.26 79.46,46.29 v3(79.76,45.99)
  Bottom Layer w0.254: v3(79.76,45.99) 79.79,46.03 U9.3
B2: length 13.2
  Top Layer w0.254: U1.1 v2(76.71,48.29)
  Bottom Layer w0.254: v2(76.71,48.29) 89.23,48.29 U9.4
B_5V: length 55.8
  Top Layer w0.254: R45.1 v2(65.79,50.69) ; v2(65.79,32.91) 65.66,32.78 65.66,29.23 63.88,27.45 35.39,27.45 OPI1.32
  Bottom Layer w0.254: v2(65.79,50.69) v2(65.79,32.91)
B_24V: length 110.2
  Top Layer w0.254: R44.1 128.28,32.91 v2(122.17,32.91)
  Bottom Layer w0.254: OPI1.33 33.29,30.37 73.53,30.37 81.79,22.11 119.25,22.11 122.17,25.03 v2(122.17,32.91)
EPHY-RXN: length 74.2
  Top Layer w0.254: FPC2.18 FPC1.18
EPHY-RXP: length 74.2
  Top Layer w0.254: FPC1.17 FPC2.17
EPHY-TXN: length 74.2
  Top Layer w0.254: FPC2.15 FPC1.15
EPHY-TXP: length 74.2
  Top Layer w0.254: FPC1.14 FPC2.14
FAN: length 65.9
  Top Layer w0.254: U7.3 84.07,66.18 75.31,57.42 70.61,57.42 67.56,54.37 67.56,50.94 64.13,47.51 64.13,32.02 62.48,30.37 52.7,30.37 51.93,29.59 OPI1.25
GPIO: length 6.2
  Top Layer w0.254: U5.14 26.48,39.2 25.26,37.97 R10.2 25.14,37.91 R25.1
LANWEAK: length 5.4
  Top Layer w0.254: U5.19 30.73,41.09 R23.1
LED_LINK: length 28.3
  Top Layer w0.254: v2(27.05,39) 26.98,39.07 U5.15 ; v2(32.39,39) 35.56,39 36.58,40.02 R11.1
  Bottom Layer w0.254: v2(27.05,39) v2(32.39,39)
LED_SPEED: length 27.8
  Top Layer w0.254: U5.17 27.98,41 v2(28.32,40.66) ; v2(18.03,54.25) R12.2
  Bottom Layer w0.254: v2(18.03,54.25) 18.03,41.55 21.08,38.5 25.53,38.5 27.69,40.66 v2(28.32,40.66)
LEFT: length 36.5
  Top Layer w0.254: OPI2.33 106.95,29.99 116.46,29.99 117.09,29.35 117.09,24.4 118.87,22.62 R43.2
MOTOR_DIR: length 64
  Top Layer w0.254: v2(75.44,40.66) 75.44,43.25 U1.19
  Bottom Layer w0.254: v2(75.44,40.66) 78.23,37.86 123.19,37.86 131.05,30 OPI2.23
MOTOR_EN: length 5.6
  Top Layer w0.254: U1.2 75.91,52.19 75.94,52.22 ; 75.94,52.22 R13.2 ; 75.94,52.22 R38.1
MOTOR_EN_PIN: length 52.6
  Top Layer w0.254: R13.1 75.95,53.85 75.95,54.63 78.49,57.17 96.39,57.17 97.28,56.28 97.28,45.74 100.57,42.45 OPI2.35
MOTOR_STEP: length 62.9
  Top Layer w0.254: U1.16 73.91,42.05 v2(73.53,41.67)
  Bottom Layer w0.254: OPI2.25 125.97,34.32 122.94,37.35 77.85,37.35 v2(73.53,41.67)
NET_DM: length 18
  Top Layer w0.254: H1.3 19.81,53.48 23.37,49.93 23.37,45.74 24,45.1 U5.7
NET_DP: length 17
  Top Layer w0.254: H2.3 21.59,50.94 22.86,49.67 22.86,45.61 23.87,44.6 U5.8
PI19_1: length 44.3
  Top Layer w0.254: OPI1.15 49.39,25.16 49.13,24.91 30.35,24.91 25.4,19.95 25.05,19.95 v1(25.05,16.78) ; H3.7 27.43,7.13 25.05,9.51 v1(25.05,11.83)
  Bottom Layer w0.254: v1(25.05,16.78) v1(25.05,11.83)
PI20_1: length 36.6
  Top Layer w0.254: H3.3 29.84,16.65 v1(27.56,16.65) ; v1(26.29,17.67) 26.29,18.94 25.65,19.57 30.61,24.53 51.31,24.53 51.93,25.15 OPI1.16
  Bottom Layer w0.254: v1(27.56,16.65) 27.31,16.65 v1(26.29,17.67)
PI23_1: length 33.4
  Bottom Layer w0.254: OPI1.18 40.52,9.67 v2(33.53,9.67)
  Bottom Layer w0.3: v2(33.53,9.67) H3.6
PI23_2: length 21.2
  Top Layer w0.254: R37.1 130.55,32.16 131.19,31.51 135.51,31.51 137.54,29.48 137.54,27.96 137.03,27.45 132.35,27.45 OPI2.18
PI25_2: length 30.1
  Top Layer w0.254: OPI2.19 130.57,23.13 120.65,23.13 119.63,24.15 119.63,29.48 118.75,30.37 113.03,30.37 112.01,31.39 R34.1
PI26_2: length 20
  Top Layer w0.254: OPI2.22 132.29,29.99 119.89,29.99 119,30.88 115.95,30.88 115.44,31.39 R35.1
PI27_2: length 18.7
  Top Layer w0.254: OPI2.21 133.94,30.88 121.03,30.88 119.75,32.16 R36.1
RIGHT: length 37.1
  Top Layer w0.254: R42.2 125.98,11.32 114.55,22.75 114.55,26.94 114.05,27.45 109.43,27.45 OPI2.32
SCL_1: length 95
  Top Layer w0.254: U10.23 43.6,34.77 42.56,35.81 U4.10 39.96,35.81 37.19,33.04 23.11,33.04 20.19,30.11 20.19,26.94 19.4,26.15 OPI1.3 18.32,26.15 17.14,27.32 15.75,27.32 15.11,27.96 15.11,29.35 12.95,31.51 R4.1 ; v2(36.96,31) 61.21,31 61.97,31.76 U18.2
  Bottom Layer w0.254: OPI1.3 19.4,26.15 20.19,26.94 20.19,30.11 21.08,31 v2(36.96,31)
SCL_2: length 10.3
  Top Layer w0.254: U19.2 92.95,30.89 94.23,29.61 94.23,26.81 93.57,26.15 OPI2.3 92.95,23.65 R40.1
SDA_1: length 66
  Top Layer w0.254: R5.1 9.78,29.86 12.19,27.45 14.61,27.45 15.9,26.15 OPI1.2 16.37,25.43 16.76,25.03 21.97,25.03 22.73,25.8 22.73,29.61 25.78,32.66 37.37,32.66 40.03,35.31 U4.9 42.43,35.31 43.47,34.27 44.04,34.27 44.04,33.06 45.59,31.51 59.69,31.51 60.72,32.54 U18.3
SDA_2: length 9.4
  Top Layer w0.254: U19.3 91.7,27.45 OPI2.2 90.41,23.65 R39.1
SPI_SDI: length 4.3
  Top Layer w0.254: 28.48,41.86 29.08,41.26 R24.1
UART0_RX_2: length 50.9
  Top Layer w0.254: R28.2 99.31,21.48 98.04,20.21 83.31,20.21 68.07,35.45 68.07,40.53 68.06,40.54 R14.2 69.84,41.8 R26.2 70.6,41.79 72.41,43.59 U1.14
UART0_TX_2: length 39.6
  Top Layer w0.254: R27.2 96.77,21.35 96.01,20.59 83.69,20.59 69.85,34.43 R26.1
UART5_RX_1: length 16.6
  Bottom Layer w0.2: H3.4 28.32,16.91 28.32,18.69 31.37,18.69 31.75,19.07 31.75,23.47 OPI1.7
UART5_TX_1: length 22.9
  Top Layer w0.2: H3.5 30.86,12.21 v1(32.13,13.48)
  Bottom Layer w0.2: OPI1.6 27.95,27.58 31.75,27.58 32.89,26.43 32.89,14.24 v1(32.13,13.48)
USB2-DM1: length 68
  Top Layer w0.254: FPC1.21 33.59,12.91 31.75,14.75 31.75,15.38 31.24,15.89 27.05,15.89 25.91,14.75 3.3,14.75 2.03,16.02 2.03,37.1 6.84,41.91 USB0.2
USB2-DP1: length 68.5
  Top Layer w0.254: FPC1.20 33.72,13.41 32.89,14.24 32.89,17.92 32.26,18.56 28.32,18.56 25.78,16.02 2.92,16.02 2.54,16.4 2.54,36.72 5.73,39.91 USB0.3
USB3-DM1: length 84.1
  Top Layer w0.254: v2(33.27,11.45) 33.74,11.91 FPC1.23
  Bottom Layer w0.2: H1.2 10.67,54.12 9.02,55.77 5.97,55.77 2.03,51.83 2.03,14.62 5.84,10.81 31.62,10.81 31.88,11.06 32.51,11.06 32.89,11.45 v2(33.27,11.45)
USB3-DP1: length 78.6
  Top Layer w0.254: v2(32.13,11.95) 32.59,12.41 FPC1.22
  Bottom Layer w0.2: v2(32.13,11.95) 32.13,12.59 31.24,13.48 29.84,13.48 27.94,11.57 25.78,11.57 25.4,11.19 6.22,11.19 2.54,14.88 2.54,46.5 5.08,49.04 9.78,49.04 10.67,49.93 H2.2
USB-DM: length 11.4
  Top Layer w0.254: H1.1 7.37,53.48 6.86,53.99 6.86,61.61 7.89,62.64 USB1.2
USB-DP: length 15.9
  Top Layer w0.254: USB1.3 5.97,61.91 5.97,52.85 7.87,50.94 H2.1
$1N38473: length 6.2
  Top Layer w0.254: 74.17,53.73 C1.2 74.91,52.67 U1.4
$1N38474: length 4.3
  Top Layer w0.254: C1.1 74.41,51.78 U1.5
$1N38475: length 24.7
  Top Layer w0.762: U2.3 128.21,56.79 U2.6 125.92,64.2 U3.2 119.58,64.15 L1.2
$1N38480: length 5.1
  Top Layer w0.762: R2.2 126.1,53.23 R1.1 126.19,53.33 U2.2
$1N38481: length 3.3
  Top Layer w0.762: U2.4 129.73,56.34 129.73,53.23
$1N38482: length 2.4
  Top Layer w0.254: LED1.1 124.55,47.26 R3.1
$1N38490: length 8.3
  Top Layer w0.254: R7.2 40.64,39.37 R6.1 39.05,35.64 37.72,34.31 36.66,34.31 U4.4
$1N38493: length 6
  Top Layer w0.254: U5.24 29.82,45.09 33.41,48.68 R8.1
$1N38528: length 10
  Top Layer w0.254: U5.21 29.77,43.59 33.33,40.02 34.54,40.02 35.18,40.65 C8.2 35.18,42.91 X1.3
$1N38529: length 7.1
  Top Layer w0.254: C9.1 33.52,45.21 X1.1 33.47,44.67 32.89,44.09 U5.22
$1N38562: length 4.9
  Top Layer w0.254: C10.2 71.95,51.77 73.91,49.81 U1.6
$1N38563: length 6
  Top Layer w0.254: 70.04,52.33 70.04,51.51 72.41,49.15 72.41,47.29
$1N38568: length 4
  Top Layer w0.254: U1.27 77.44,46.75 R16.1
$1N38569: length 4
  Top Layer w0.254: U1.23 81.35,44.78 R15.1
$1N38570: length 6.1
  Top Layer w0.254: R17.2 R19.2 72.39,46.81 U1.9
$1N38571: length 6.5
  Top Layer w0.254: R18.2 R20.2 69.14,45.16 70.27,46.29 U1.10
$1N38576: length 2.3
  Top Layer w0.254: R21.3 77.77,34.13 R22.1
$1N38578: length 5.9
  Top Layer w0.254: R21.2 74.41,37.46 U1.17
$1N38674: length 5.9
  Top Layer w0.254: R27.1 96.77,27.96 96.04,28.69 OPI2.37
$1N38675: length 6
  Top Layer w0.254: R28.1 99.31,28.08 98.71,28.69 OPI2.36
$1N38710: length 1.7
  Top Layer w0.254: R9.1 33.41,52.12 LED2.2
$1N38711: length 2.1
  Top Layer w0.254: R10.1 25.11,36.37 25.11,34.43
$1N38748: length 14.9
  Top Layer w0.508: R38.2 77.47,54.63 77.34,54.75 77.34,54.88 78.36,55.9 U8.1 U8.2
$1N38749: length 3.1
  Top Layer w0.254: C35.1 49.41,35.77 U10.10
$1N38755: length 4.3
  Top Layer w0.254: C34.1 42.42,39.31 42.42,36.97 43.12,36.27 44.04,36.27
$1N38758: length 2.5
  Top Layer w0.254: 48.04,35.27 50.5,35.27 R31.2
$1N38778: length 1.8
  Top Layer w0.254: U12.1 112.01,35.46 R34.2
$1N38779: length 1.8
  Top Layer w0.254: R35.2 115.44,33.67 U13.1
$1N38780: length 1.8
  Top Layer w0.254: R36.2 118.87,33.67 U14.1
$1N38784: length 5.3
  Top Layer w0.254: U15.5 119.38,42.06 119.82,41.62 U14.3
$1N38785: length 4.6
  Top Layer w0.254: U13.3 116.39,42.02 U15.4
$1N38786: length 5.3
  Top Layer w0.254: U15.3 113.85,37.79 113.53,37.47 U12.3
$1N38794: length 2
  Top Layer w0.254: R37.2 126.18,33.72 126.18,35.59
$1N38808: length 4.1
  Top Layer w0.254: U16.3 127.16,37.63 laser1.1
$1N39146: length 2.9
  Top Layer w0.254: R11.2 36.56,57.02 RJ2.12
$1N39198: length 23.7
  Top Layer w0.254: RJ2.1 22.86,66.44 27.97,61.33 U5.2
$1N39209: length 28.3
  Top Layer w0.254: U5.3 27.47,61.06 21.59,66.94 21.59,68.6 23.01,70.02 RJ2.2
$1N39216: length 10.3
  Top Layer w0.254: RJ2.5 27.94,66.82 28.58,66.18 31.62,66.18 33.46,68.02 C13.2
$1N39220: length 10.4
  Top Layer w0.254: RJ2.4 26.67,70.5 26.11,71.06 19.1,71.06 18.09,70.05 C14.2
$1N39224: length 22.3
  Top Layer w0.254: U5.4 26.97,60.67 v1(25.4,62.25)
  Bottom Layer w0.254: v1(25.4,62.25) RJ2.3
$1N39235: length 25.5
  Top Layer w0.254: v2(26.16,60.47) 26.16,46.75 26.47,46.44 U5.5
  Bottom Layer w0.254: RJ2.6 29.21,63.52 v2(26.16,60.47)
$1N39249: length 7.5
  Top Layer w0.254: RJ2.10 23.44,57.86 22.73,58.56 18.92,58.56 18.03,57.67 R12.1
$1N42247: length 3.5
  Top Layer w0.254: R41.2 142.35,10.32 R42.1
$1N42261: length 3.5
  Top Layer w0.254: R43.1 142.35,21.62 L2.2
$1N42789: length 3.7
  Top Layer w0.254: R44.2 133.68,33.16 U20.1
$1N42792: length 4.3
  Top Layer w0.254: U21.1 65.8,53.74 R45.2
$1N43160: length 3.1
  Top Layer w0.762: R50.1 139.19,47.54 Q1.3
$1N43377: length 5.5
  Top Layer w0.508: 5V2.2 72.75,60.21 Q4.3
$1N43380: length 5
  Top Layer w0.762: BAT2.2 142.62,40.25 Q3.3
$1N70553: length 8.2
  Top Layer w0.762: R49.1 75.32,65.92 74.42,66.82 68.84,66.82 U21.3
$1N70586: length 4.4
  Top Layer w0.762: R52.2 78.86,65.81 Q2.1 76.83,66.38 R49.2
$1N70757: length 7.7
  Top Layer w0.254: R47.1 73.27,68.37 Q4.1
  Top Layer w0.762: R51.2 77.1,70.73 76.31,69.94 76.31,68.82 Q2.3 75.44,67.94 Q4.1
$1N70790: length 4.9
  Top Layer w0.762: R48.1 138.42,39.64 136.78,39.64 136.27,40.15 U20.3
$1N70825: length 4.3
  Top Layer w0.762: R46.1 138.02,43.59 Q1.1 138.56,43.28 R48.2
$1N70995: length 27.4
  Top Layer w0.254: R53.1 144.15,50.05 v1(145.16,51.07)
  Top Layer w0.762: R50.2 135.18,47.54 R54.2 133.6,46.24 132.08,46.24 ; Q3.1 143.57,49.6 R53.1
  Bottom Layer w0.254: v1(131.88,46.24) 131.88,48.46 134.49,51.07 v1(145.16,51.07)

## Copper pours and planes (outline as drawn; the poured copper is in the pictures)
GND on Top Layer: 152.65,-61.2 -3.43,-61.2 -3.43,124.98 152.65,124.98
GND on Bottom Layer: -112.52,79.77 230.5,79.77 230.5,-0.11 -112.52,-0.11

Small or netless copper shapes (teardrops, artwork), in the pictures only: 543 on Top Layer, 105 on Bottom Layer

## Text on the board
Top Silkscreen Layer: USB1 DM NET | 2024/07/30 | 赤兔_V2.0
